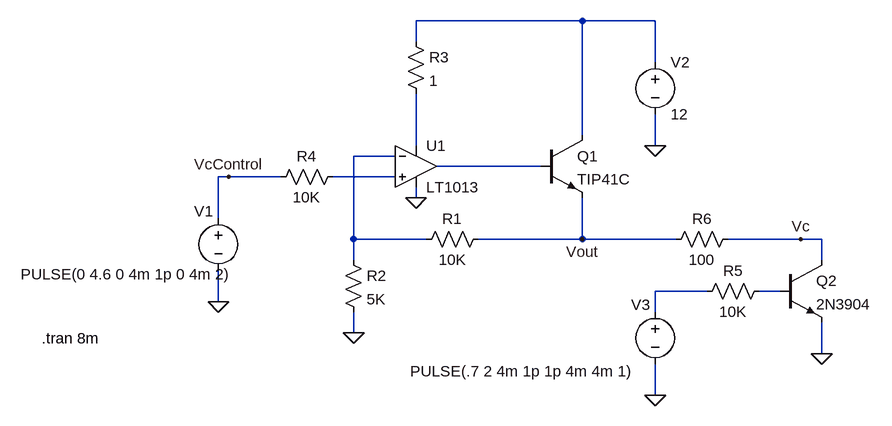
[diagram p0: schematic NPN Opamp Configuration.asc]
NPN Opamp Configuration.asc, the LTspice schematic file:
Version 4
SHEET 1 1400 680
WIRE 816 -128 560 -128
WIRE 928 -128 816 -128
WIRE 560 -96 560 -128
WIRE 928 -64 928 -128
WIRE 816 48 816 -128
WIRE 560 64 560 -16
WIRE 928 64 928 16
WIRE 528 80 464 80
WIRE 752 96 592 96
WIRE 272 112 256 112
WIRE 352 112 272 112
WIRE 528 112 432 112
WIRE 560 144 560 128
WIRE 256 176 256 112
WIRE 464 208 464 80
WIRE 576 208 464 208
WIRE 816 208 816 144
WIRE 816 208 656 208
WIRE 960 208 816 208
WIRE 1152 208 1040 208
WIRE 1184 208 1152 208
WIRE 464 240 464 208
WIRE 1184 240 1184 208
WIRE 1008 288 928 288
WIRE 1120 288 1088 288
WIRE 256 304 256 256
WIRE 928 320 928 288
WIRE 464 352 464 320
WIRE 1184 384 1184 336
WIRE 928 448 928 400
FLAG 256 304 0
FLAG 928 64 0
FLAG 1184 384 0
FLAG 464 352 0
FLAG 560 144 0
FLAG 272 112 VcControl
FLAG 816 208 Vout
FLAG 1152 208 Vc
FLAG 928 448 0
SYMBOL voltage 256 160 R0
WINDOW 0 -37 5 Left 2
WINDOW 3 -304 102 Left 2
WINDOW 123 0 0 Left 2
WINDOW 39 0 0 Left 2
SYMATTR InstName V1
SYMATTR Value PULSE(0 4.6 0 4m 1p 0 4m 2)
SYMBOL voltage 928 -80 R0
WINDOW 123 0 0 Left 2
WINDOW 39 0 0 Left 2
SYMATTR InstName V2
SYMATTR Value 12
SYMBOL res 672 192 R90
WINDOW 0 0 56 VBottom 2
WINDOW 3 32 56 VTop 2
SYMATTR InstName R1
SYMATTR Value 10K
SYMBOL npn 752 48 R0
SYMATTR InstName Q1
SYMATTR Value TIP41C
SYMBOL Opamps\\LT1013 560 32 R0
SYMATTR InstName U1
SYMBOL res 448 224 R0
SYMATTR InstName R2
SYMATTR Value 5K
SYMBOL res 544 -112 R0
SYMATTR InstName R3
SYMATTR Value 1
SYMBOL res 448 96 R90
WINDOW 0 0 56 VBottom 2
WINDOW 3 32 56 VTop 2
SYMATTR InstName R4
SYMATTR Value 10K
SYMBOL npn 1120 240 R0
SYMATTR InstName Q2
SYMATTR Value 2N3904
SYMBOL res 1056 192 R90
WINDOW 0 0 56 VBottom 2
WINDOW 3 32 56 VTop 2
SYMATTR InstName R6
SYMATTR Value 100
SYMBOL voltage 928 304 R0
WINDOW 0 -37 5 Left 2
WINDOW 3 -377 107 Left 2
WINDOW 123 0 0 Left 2
WINDOW 39 0 0 Left 2
SYMATTR InstName V3
SYMATTR Value PULSE(.7 2 4m 1p 1p 4m 4m 1)
SYMBOL res 1104 272 R90
WINDOW 0 0 56 VBottom 2
WINDOW 3 32 56 VTop 2
SYMATTR InstName R5
SYMATTR Value 10K
TEXT -16 360 Left 2 !.tran 8m

The netlist it stands for:
* NPN Opamp Configuration.asc
V1 VcControl 0 PULSE(0 4.6 0 4m 1p 0 4m 2)
V2 N001 0 12
R1 Vout N003 10K
Q1 N001 N004 Vout 0 TIP41C
XU1 N005 N003 N002 0 N004 LT1013  ; pins In+ In- V+ V- OUT
R2 N003 0 5K
R3 N001 N002 1
R4 N005 VcControl 10K
Q2 Vc N007 0 0 2N3904
R6 Vc Vout 100
V3 N006 0 PULSE(.7 2 4m 1p 1p 4m 4m 1)
R5 N007 N006 10K
.model NPN NPN
.model PNP PNP
.lib standard.bjt
.tran 8m
.lib LTC.lib
.backanno
.end